# EAGLE schematic schematic (EAGLE 9.6.2)
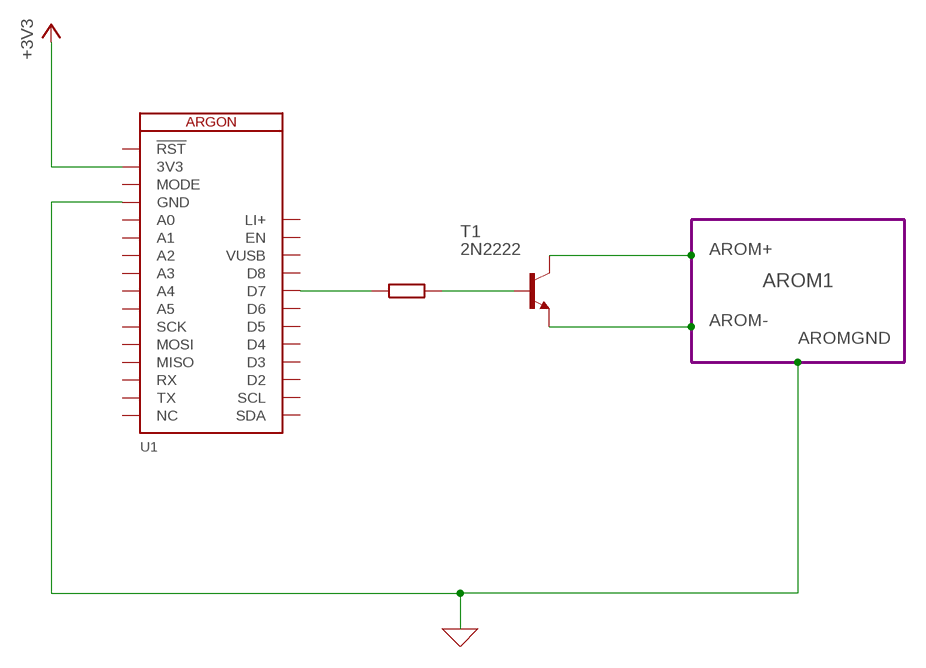
[diagram p0: schematic, sheet 1]

## Parts
T1  2N2222  [TO18]
U1  ARGON  [ARGON]

## Module instances
AROM1 = AROMATIZER

## Nets
+3V3: U1.2(3V3)
AROM+: T1.3(C)
AROM-: T1.1(E)
AROMGND: U1.4(GND) ; supply symbol labelled GND
N$1: U1.24(D7)
N$2: T1.2(B)
Unconnected: U1.1(!RST) U1.3(MODE) U1.5(A0) U1.6(A1) U1.7(A2) U1.8(A3) U1.9(A4) U1.10(A5) U1.11(SCK) U1.12(MOSI) U1.13(MISO) U1.14(RX) U1.15(TX) U1.16(NC) U1.17(SDA) U1.18(SCL) U1.19(D2) U1.20(D3) U1.21(D4) U1.22(D5) U1.23(D6) U1.25(D8) U1.27(EN)

## Power pins joined to a net without a drawn wire
LI+: U1.28(LI+)
VUSB: U1.26(VUSB)

## Library data of the parts
T1 = transistor:2N2222: NPN TRANSISTOR
U1 = Particle-Devices:ARGON: ARGON The Particle Argon is a powerful Wi-Fi development kit that you can use as a standalone Wi-Fi device or Wi-Fi enabled gateway, repeater, or endpoint for Particle Mesh networks. More information: https://docs.particle.io/argon/ Footprint and formfactor based on Adafruit Feather. <https://www.adafruit.com/feather>

## Module AROMATIZER
Ports: 

### Library data of the parts